# Altium schematic sheet Power_Sheet.SchDoc: Power Sheet
size A4; DrawnBy: Project_Vega_Team; Revision: 1; SheetNumber: 3; SheetTotal: 7
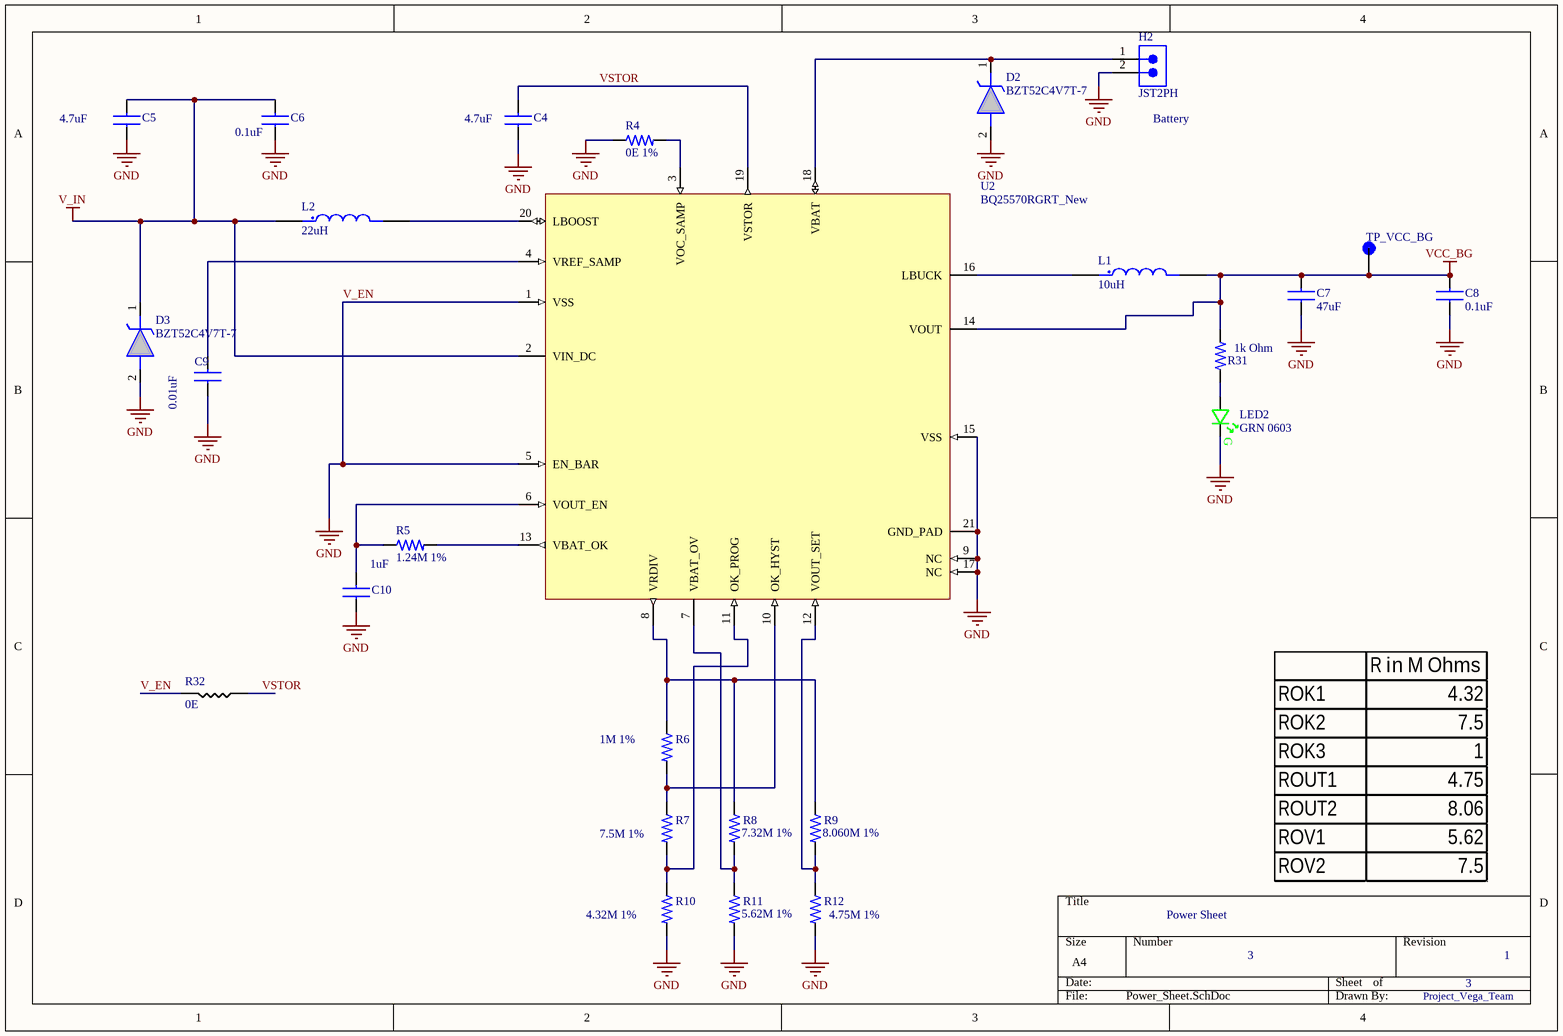
[diagram p0: Power_Sheet.SchDoc]

## Parts
C4  4.7uF  [CAP_0603_1MM]
C5  4.7uF  [CAP_0603_1MM]
C6  0.1uF  [CAP_0603_1MM]
C7  47uF  [CAP_0603_1MM]
C8  0.1uF  [CAP_0603_1MM]
C9  0.01uF  [CAP_0603_1MM]
C10  1uF  [CAP_0603_1MM]
D2  BZT52C4V7T-7  [SOD3715X135N]
D3  BZT52C4V7T-7  [SOD3715X135N]
H2  JST2PH  [JST_B2B-PH-K-S(LF)(SN)]
L1  10uH  [IND_LPS4018-103MRB]
L2  22uH  [IND_LPS4018-223MRC]
LED2  GRN 0603  [LED_0603_GRN_WL-SMCW]
R4  0E 1%  [RES_0603_1608X06]
R5  1.24M 1%  [RES_0603_1608X06]
R6  1M 1%  [RES_0603_1608X06]
R7  7.5M 1%  [RES_0603_1608X06]
R8  7.32M 1%  [RES_0603_1608X06]
R9  8.060M 1%  [RES_0603_1608X06]
R10  4.32M 1%  [RES_0603_1608X06]
R11  5.62M 1%  [RES_0603_1608X06]
R12  4.75M 1%  [RES_0603_1608X06]
R31  1k Ohm  [RES_0603]
R32  value 0E  [1206_Passive_Resitor]  (hidden comment: 10k)
TP_VCC_BG  Test_point  [1]  (value not drawn)
U2  BQ25570RGRT_New  [QFN50P350X350X100-21N - duplicate]

## Nets
V_EN: C4.1 C5.1 C6.1 C7.1 C8.1 C9.1 C10.1 D2.2(A) D3.2(A) H2.2 LED2.C R4.1 R10.2 R11.2 R12.2 R32.2 U2.1(VSS) U2.5(EN_BAR) U2.9(NC) U2.15(VSS) U2.17(NC) U2.21(GND_PAD)  [also labelled GND]
V_IN: C5.2 C6.2 D3.1(K) L2.1 U2.2(VIN_DC)
VCC_BG: C7.2 C8.2 L1.2 R31.2 TP_VCC_BG.TP(VCC_BG) U2.14(VOUT)
VSTOR: C4.2 R32.1 U2.19(VSTOR)
NetC9_2: C9.2 U2.4(VREF_SAMP)
NetC10_2: C10.2 R5.1 U2.6(VOUT_EN)
NetD2_1: D2.1(K) H2.1 U2.18(VBAT)
NetL1_1: L1.1 U2.16(LBUCK)
NetL2_2: L2.2 U2.20(LBOOST)
NetLED2_A: LED2.A R31.1
NetR4_2: R4.2 U2.3(VOC_SAMP)
NetR5_2: R5.2 U2.13(VBAT_OK)
NetR6_1: R6.1 R8.1 R9.1 U2.8(VRDIV)
NetR6_2: R6.2 R7.1 U2.10(OK_HYST)
NetR7_2: R7.2 R10.1 U2.11(OK_PROG)
NetR8_2: R8.2 R11.1 U2.7(VBAT_OV)
NetR9_2: R9.2 R12.1 U2.12(VOUT_SET)

## Notes on the sheet
- (near H2) Battery
- (in symbol LED_green) G

## Library data of the parts
C4-C10 = GRM188R61A226ME15D: CAP CER 22UF 10V X5R 0603; Manufacturer: Murata; Voltage Rating DC: 10 VDC; Tolerance: 20 %; Brand: Murata Electronics; Type: Voltage and Temperature Derating Recommended Product; Unit Weight: 0.000222 oz; Supplier 1: Digi-Key; Supplier Part Number 1: 490-10476-1-ND; Manufacturer Part Number: GRM188R61A226ME15D; Stock 1: 849458; Pricing 1: 1=0.33, 10=0.226, 50=0.1506, 100=0.1279, 500=0.0903, 1000=0.079 (USD); Product Category: Multilayer Ceramic Capacitors MLCC - SMD/SMT; RoHS: True; Capacitance: 22 uF; Dielectric: X5R; Case Code - in: 0603; Case Code - mm: 1608; Height: 0.8 mm; Maximum Operating Temperature: + 85 C; Minimum Operating Temperature: - 55 C; Product: General Type MLCCs; Series: GRM; Packaging: Reel; Length: 1.6 mm; Package / Case: 0603 (1608 metric); Factory Pack Quantity: 4000; Termination Style: SMD/SMT; Width: 0.8 mm; ComponentLink1URL: http://www.farnell.com/datasheets/2047978.pdf?src-supplier=Element14; ComponentLink1Description: http://www.farnell.com/datasheets/2047978.pdf?src-supplier=Element14
D2 D3 = BZT52C4V7T-7: Diode Zener Single 4.7V 6% 300mW 2-Pin SOD-523 T/R; Manufacturer_Name: Diodes Incorporated; Manufacturer: Diodes; Geometry.Height: 0.65mm; Impedance: 80R; Max Reverse Leakage Current: 3uA; Zener Current: 5mA; ESD Protection: No; Mouser Part Number: 621-BZT52C4V7T-7; Mouser Price/Stock: https://www.mouser.co.uk/ProductDetail/Diodes-Incorporated/BZT52C4V7T-7?qs=zLeapIUCO8SroLebLeUNYA%3D%3D; Manufacturer_Part_Number: BZT52C4V7T-7; Datasheet Link: https://www.diodes.com//assets/Datasheets/ds30502.pdf; Supplier: Digikey; Supplier Part Number: BZT52C4V7T-7DICT-ND; Manufacturer Part Number: BZT52C4V7T-7; RoHS: Yes; Category: Zener Diodes; Stock: 25726; Pricing: 1=0.12, 10=0.08, 100=0.0538, 500=0.0408, 1000=0.03639 (USD); Mounting Technology: Surface Mount; Pins: 2; Weight: 3.5E-05oz; Contact Plating: Tin,Matte; Min Operating Temperature: -65°C; Max Operating Temperature: 150°C; Packaging: Tape and Reel; Package Quantity: 3000; Tolerance: 6%; Max Power Dissipation: 300mW; Zener Voltage: 4.7V; Power Dissipation: 300mW; Voltage Tolerance: 6%; Test Current: 5mA; Termination: SMD/SMT; Max Reverse Current: 3uA; Power Rating: 300mW; Series: -; Length: 1.3mm; Width: 0.9mm; Height: 0.7mm; RoHS Compliant: Yes; ComponentLink1URL: https://datasheet.ciiva.com/25623/0900766b8104c33b-25623740.pdf?src-supplier=Rs; ComponentLink1Description: https://datasheet.ciiva.com/25623/0900766b8104c33b-25623740.pdf?src-supplier=Rs; ComponentLink2URL: https://datasheet.ciiva.com/4734/ds30502-85251-4734173.pdf?src-supplier=Mouser; ComponentLink2Description: https://datasheet.ciiva.com/4734/ds30502-85251-4734173.pdf?src-supplier=Mouser
H2 = JST2PH: Connector Header Through Hole 2 position 0.079" (2.00mm); Manufacturer: JST; Manufacturer Part Number: B2B-PH-K-S; Supplier: Digi-Key; Supplier Part Number: 455-1704-ND; RoHS: Yes; Category: Connectors; Stock: 1077617; Pricing: 1=0.19, 10=0.147, 100=0.1088, 500=0.09006, 1000=0.0788, 5000=0.06754, 10000=0.06567 (USD); ComponentLink1URL: https://datasheet.ciiva.com/6905/phseries-6905929.pdf?src-supplier=Digi-Key; ComponentLink1Description: https://datasheet.ciiva.com/6905/phseries-6905929.pdf?src-supplier=Digi-Key
L1 = LPS4018-103MRB: Power inductor, shielded, 20/30% tol, SMT, RoHS, lead-free, halogen-free; MF: Coilcraft; SnapEDA_Link: https://www.snapeda.com/parts/LPS4018-103MRB/Coilcraft/view-part/?ref=snap; Package: None; Value: *; MP: LPS4018-103MRB; Check_prices: https://www.snapeda.com/parts/LPS4018-103MRB/Coilcraft/view-part/?ref=eda
L2 = LPS4018-223MRC: 22 µH Shielded Drum Core Inductor 650 mA 360mOhm Max Nonstandard; MF: Coilcraft; SnapEDA_Link: https://www.snapeda.com/parts/LPS4018-223MRC/Coilcraft/view-part/?ref=snap; Package: None; Value: *; MP: LPS4018-223MRC; Check_prices: https://www.snapeda.com/parts/LPS4018-223MRC/Coilcraft/view-part/?ref=eda
LED2 = LED_green: 430mcd Colorless transparence 520nm Emerald 140° LED0603 Light Emitting Diodes (LED) ROHS; Manufacturer: Wurth Electronics; Manufacturer Part Number: 150060GS75000; Dynamic Catalog: 0603 Rectangle with Flat Top Chip LEDs; 3D Model: SMCW_0603.igs / SMCW_0603.stp / SMCW_0603.wrl; Color: Green; Wavelength - Peak: 515nm; Voltage - Forward (Vf) (Typ): 3.2V; Current - Test: 20mA; Lens Type: Clear; Lens Style/Size: Rectangle with Flat Top, 1.1mm x 0.7mm; Other Names: 732-4971-2; Lens Style: Clear,Flat,Rectangular; Forward Current: 30mA; Max Reverse Voltage (DC): 5V; Output Current: 10uA; Power Dissipation: 105mW; Lens Size: 0.7mm; Supplier 1: Digi-Key; Stock 1: 34964; Pricing 1: 1=0.14, 50=0.129, 100=0.11, 500=0.095 (USD); Standard Package: 4,000; Category: Optoelectronics; Family: LED Indication - Discrete; Series: WL-SMCW; Packaging: Tape & Reel (TR); Wavelength - Dominant: 520nm; Millicandela Rating: 430mcd; Viewing Angle: 140°; Package / Case: 0603 (1608 Metric); Size / Dimension: 1.60mm L x 0.80mm W; Height: 0.70mm; Mounting Type: Surface Mount; Online Catalog: 0603 Rectangle with Flat Top Chip LEDs; ComponentLink1URL: https://katalog.we-online.de/led/datasheet/150060GS75000.pdf?src-supplier=Digi-Key; ComponentLink1Description: https://katalog.we-online.de/led/datasheet/150060GS75000.pdf?src-supplier=Digi-Key; ComponentLink2URL: http://www.produktinfo.conrad.com/datenblaetter/750000-774999/759427-da-01-en-CHIPLED_0603_W_KL_GRUEN_150060GS75000.pdf?src-supplier=Conrad; ComponentLink2Description: http://www.produktinfo.conrad.com/datenblaetter/750000-774999/759427-da-01-en-CHIPLED_0603_W_KL_GRUEN_150060GS75000.pdf?src-supplier=Conrad; Supplier Part Number 1: 732-4971-1-ND; Supplier: Digikey; Supplier Part Number: 732-4971-1-ND; RoHS: Yes; Stock: 122246; Pricing: 1=0.15, 50=0.142, 100=0.122, 500=0.105 (USD); Mounting Technology: Surface Mount; Case/Package: 0603; Case Code (Metric): 1608; Case Code (Imperial): 0603; Lens Color: Colorless; Min Operating Temperature: -40°C; Max Operating Temperature: 85°C; Wavelength: 520nm; Package Quantity: 1; Luminous Intensity: 430mcd; Forward Voltage: 3.2V; Dominant Wavelength: 520nm; Test Current: 20mA; Lens Transparency: Clear; Reverse Voltage: 5V; Length: 1.6mm; Width: 0.8mm; Lead Free: Lead Free; RoHS Compliant: Yes; Reach SVHC Compliant: Unknown; ComponentLink3URL: https://datasheet.ciiva.com/29562/150060gs75000-29562868.pdf?src-supplier=Digikey; ComponentLink3Description: https://datasheet.ciiva.com/29562/150060gs75000-29562868.pdf?src-supplier=Digikey; ComponentLink4URL: https://datasheet.ciiva.com/29279/759427-da-01-en-chipled-0603-w-kl-gruen-150060gs75000-29279201.pdf?src-supplier=Conrad; ComponentLink4Description: https://datasheet.ciiva.com/29279/759427-da-01-en-chipled-0603-w-kl-gruen-150060gs75000-29279201.pdf?src-supplier=Conrad; ComponentLink5URL: https://datasheet.ciiva.com/29562/150060gs75000-29562869.pdf?src-supplier=Digikey; ComponentLink5Description: https://datasheet.ciiva.com/29562/150060gs75000-29562869.pdf?src-supplier=Digikey; ComponentLink6URL: https://datasheet.ciiva.com/29562/150060gs75000-29562870.pdf?src-supplier=Digikey; ComponentLink6Description: https://datasheet.ciiva.com/29562/150060gs75000-29562870.pdf?src-supplier=Digikey
R4-R12 = RC0603FR-07316KL: SMD Chip Resistor, 316 kOhm, ± 1%, 100 mW, 0603 [1608 Metric], Thick Film, General Purpose; Manufacturer: Yageo; Value: 316kR; Power Rating: 100mW; Voltage Rating: 50V; Temperature Coefficient: 100ppm/°C; Supplier: Digikey; Supplier Part Number: 311-316KHRCT-ND; Manufacturer Part Number: RC0603FR-07316KL; RoHS: Yes; Category: Chip SMD Resistors; Stock: 149463; Pricing: 1=0.1, 10=0.019, 50=0.0112, 100=0.0093, 500=0.00622, 1000=0.00532 (USD); Mounting Technology: Surface Mount; Case/Package: 0603; Case Code (Imperial): 0603; Case Code (Metric): 1608; Min Operating Temperature: -55°C; Max Operating Temperature: 155°C; Tolerance: 1%; Packaging: Tape and Reel; Termination: SMD/SMT; Number of Terminations: 2; Max Power Dissipation: 100mW; Voltage Rating (DC): 50V; Features: Moisture Resistant; Series: RC; Lead Free: Lead Free; RoHS Compliant: Yes; ComponentLink1URL: https://datasheet.ciiva.com/2454/pyu-r-int-thick-7-2454966.pdf?src-supplier=Digikey; ComponentLink1Description: https://datasheet.ciiva.com/2454/pyu-r-int-thick-7-2454966.pdf?src-supplier=Digikey; ComponentLink2URL: https://datasheet.ciiva.com/2454/pyu-r-int-thick-7-2454967.pdf?src-supplier=Digikey; ComponentLink2Description: https://datasheet.ciiva.com/2454/pyu-r-int-thick-7-2454967.pdf?src-supplier=Digikey; ComponentLink3URL: https://datasheet.ciiva.com/2454/pyu-r-int-thick-7-2454968.pdf?src-supplier=Digikey; ComponentLink3Description: https://datasheet.ciiva.com/2454/pyu-r-int-thick-7-2454968.pdf?src-supplier=Digikey
R31 = RES_0603: Thick film general purpose resistor 0603; MP: RC0603JR-070RL; Availability: Unavailable; Package: None; Value: *; Price: None
R32 = R_10KOhm_1206: 10 kOhms ±5% 0.25W, 1/4W Chip Resistor 1206 (3216 Metric) Automotive AEC-Q200 Thick Film; MFR Part #: RMCF1206FT10K0; Digikey Link: https://www.digikey.com/en/products/detail/stackpole-electronics-inc/RMCF1206FT10K0/1759669; LCSC Part#: C17902; Type: Basic
TP_VCC_BG = Test_point: SMT Test Point- Mininature-1000 pc Reels; MP: 5019; MF: Keystone Electronics; Value: *; Availability: In Stock; Purchase-URL: https://pricing.snapeda.com/search/part/5019/?ref=eda; Package: None; Price: None
U2 = BQ25570RGRT_New: Switching Battery Charger Li-Ion/Li-Pol/Supercapacitor 110mA 2.2V to 5.5V 20-Pin VQFN EP T/R; Manufacturer: Texas Instruments; Output Current: 100mA; Operating Supply Current: 488nA; Min Supply Voltage: 100mV; Max Supply Voltage: 5.1V; Switching Frequency: 1MHz; Supplier: Digikey; Supplier Part Number: 296-37014-1-ND; Manufacturer Part Number: BQ25570RGRT; RoHS: Yes; Category: Battery Management; Stock: 646; Pricing: 1=9.11, 10=6.836, 25=6.2676, 100=5.6427 (USD); Mounting Technology: Surface Mount; Case/Package: VQFN; Pins: 20; Contact Plating: Gold; Min Operating Temperature: -40°C; Max Operating Temperature: 125°C; Packaging: Tape and Reel; Package Quantity: 250; Series: -; Radiation Hardening: No; Reach SVHC Compliant: No; Lead Free: Lead Free; RoHS Compliant: Yes; ComponentLink1URL: https://datasheet.ciiva.com/28483/1768287-28483478.pdf?src-supplier=Element14; ComponentLink1Description: https://datasheet.ciiva.com/28483/1768287-28483478.pdf?src-supplier=Element14; ComponentLink2URL: https://datasheet.ciiva.com/24110/slusbh2c-317150-24110945.pdf?src-supplier=Mouser; ComponentLink2Description: https://datasheet.ciiva.com/24110/slusbh2c-317150-24110945.pdf?src-supplier=Mouser; ComponentLink3URL: https://datasheet.ciiva.com/29590/bq25570-29590197.pdf?src-supplier=Digikey; ComponentLink3Description: https://datasheet.ciiva.com/29590/bq25570-29590197.pdf?src-supplier=Digikey; ComponentLink4URL: https://datasheet.ciiva.com/29590/bq25570-29590198.pdf?src-supplier=Digikey; ComponentLink4Description: https://datasheet.ciiva.com/29590/bq25570-29590198.pdf?src-supplier=Digikey; ComponentLink5URL: https://datasheet.ciiva.com/29892/bq25570-29892856.pdf?src-supplier=Avnet; ComponentLink5Description: https://datasheet.ciiva.com/29892/bq25570-29892856.pdf?src-supplier=Avnet; ComponentLink6URL: https://datasheet.ciiva.com/29892/bq25570-29892857.pdf?src-supplier=Avnet; ComponentLink6Description: https://datasheet.ciiva.com/29892/bq25570-29892857.pdf?src-supplier=Avnet